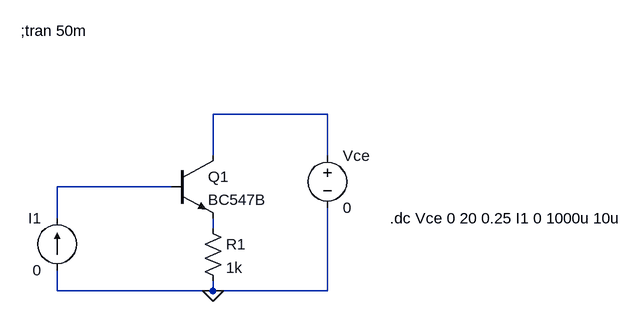
[diagram p0: schematic BC547B_bjt_curve.asc]
BC547B_bjt_curve.asc, the LTspice schematic file:
Version 4
SHEET 1 880 680
WIRE 400 48 224 48
WIRE 224 112 224 48
WIRE 400 112 400 48
WIRE 160 160 -16 160
WIRE -16 208 -16 160
WIRE 224 224 224 208
WIRE -16 320 -16 288
WIRE 224 320 224 304
WIRE 224 320 -16 320
WIRE 400 320 400 192
WIRE 400 320 224 320
FLAG 224 320 0
SYMBOL npn 160 112 R0
SYMATTR InstName Q1
SYMATTR Value BC547B
SYMBOL voltage 400 96 R0
WINDOW 123 0 0 Left 2
WINDOW 39 0 0 Left 2
SYMATTR InstName Vce
SYMATTR Value 0
SYMBOL res 208 208 R0
SYMATTR InstName R1
SYMATTR Value 1k
SYMBOL current -16 288 R180
WINDOW 0 24 80 Left 2
WINDOW 3 24 0 Left 2
WINDOW 123 0 0 Left 2
WINDOW 39 0 0 Left 2
SYMATTR InstName I1
SYMATTR Value 0
TEXT -72 -80 Left 2 !;tran 50m
TEXT 496 208 Left 2 !.dc Vce 0 20 0.25 I1 0 1000u 10u

The netlist it stands for:
* BC547B_bjt_curve.asc
Q1 N001 N002 N003 0 BC547B
Vce N001 0 0
R1 N003 0 1k
I1 0 N002 0
.model NPN NPN
.model PNP PNP
.lib standard.bjt
;tran 50m
.dc Vce 0 20 0.25 I1 0 1000u 10u
.backanno
.end